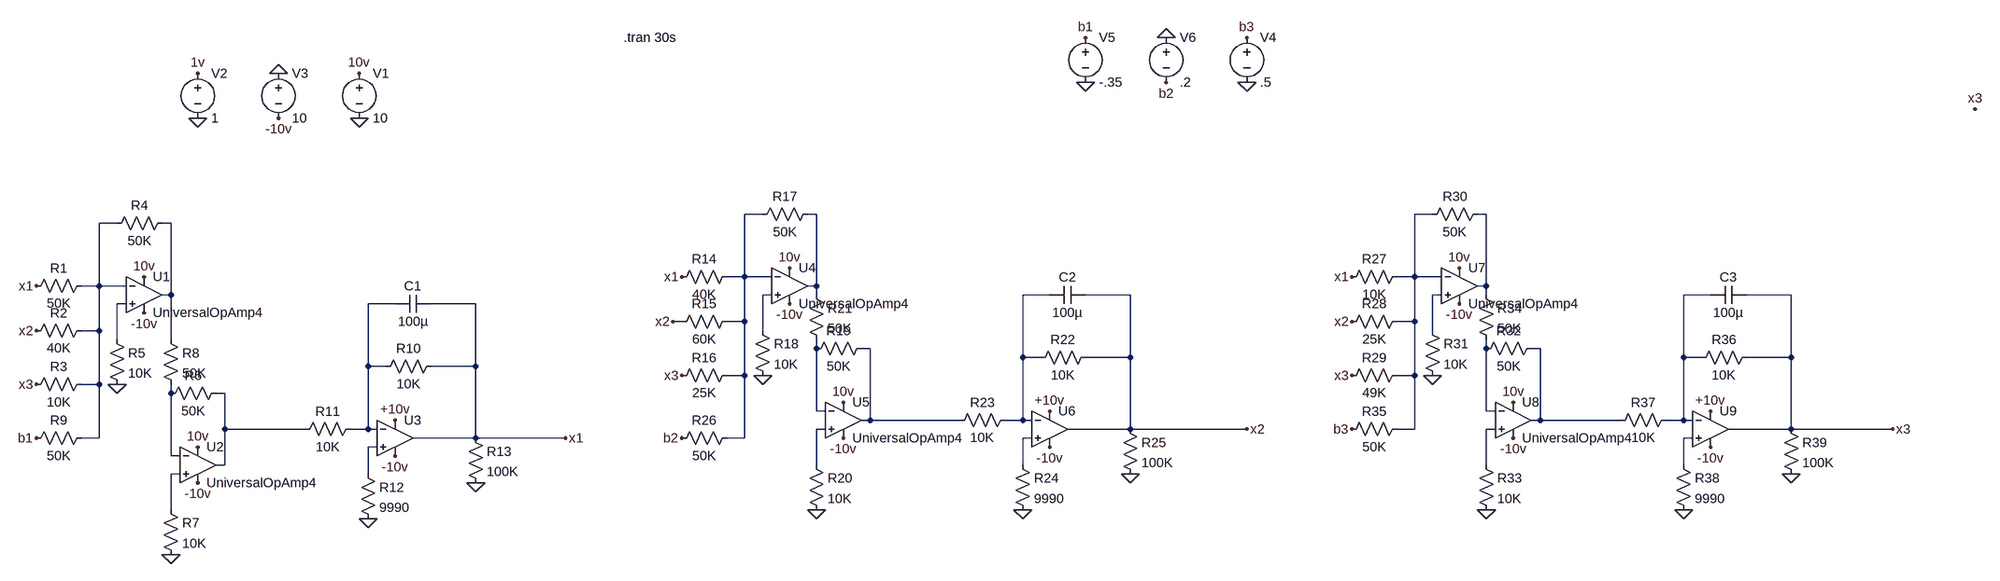
[diagram p0: schematic linear_solver.asc]
linear_solver.asc, the LTspice schematic file:
Version 4
SHEET 1 4384 2224
WIRE 640 448 608 448
WIRE 736 448 720 448
WIRE 1872 448 1840 448
WIRE 1968 448 1952 448
WIRE -512 464 -544 464
WIRE -416 464 -432 464
WIRE 608 560 608 448
WIRE 608 560 576 560
WIRE 656 560 608 560
WIRE 1840 560 1840 448
WIRE 1840 560 1808 560
WIRE 1888 560 1840 560
WIRE -544 576 -544 464
WIRE -544 576 -576 576
WIRE -496 576 -544 576
WIRE 736 576 736 448
WIRE 736 576 720 576
WIRE 1968 576 1968 448
WIRE 1968 576 1952 576
WIRE -416 592 -416 464
WIRE -416 592 -432 592
WIRE 656 592 640 592
WIRE 736 592 736 576
WIRE 1152 592 1104 592
WIRE 1296 592 1216 592
WIRE 1888 592 1872 592
WIRE 1968 592 1968 576
WIRE 2368 592 2320 592
WIRE 2512 592 2432 592
WIRE -496 608 -512 608
WIRE -16 608 -64 608
WIRE 128 608 48 608
WIRE 496 640 480 640
WIRE 608 640 608 560
WIRE 608 640 576 640
WIRE 1840 640 1840 560
WIRE 1840 640 1808 640
WIRE -544 656 -544 576
WIRE -544 656 -576 656
WIRE 640 656 640 592
WIRE 1872 656 1872 592
WIRE -512 672 -512 608
WIRE -416 672 -416 592
WIRE 736 688 736 672
WIRE 832 688 816 688
WIRE 1968 688 1968 672
WIRE 2064 688 2048 688
WIRE 1104 704 1104 592
WIRE 1136 704 1104 704
WIRE 1296 704 1296 592
WIRE 1296 704 1216 704
WIRE 2320 704 2320 592
WIRE 2352 704 2320 704
WIRE 2512 704 2512 592
WIRE 2512 704 2432 704
WIRE -64 720 -64 608
WIRE -32 720 -64 720
WIRE 128 720 128 608
WIRE 128 720 48 720
WIRE 608 736 608 640
WIRE 608 736 576 736
WIRE 1840 736 1840 640
WIRE 1840 736 1808 736
WIRE -544 752 -544 656
WIRE -544 752 -576 752
WIRE -416 768 -416 752
WIRE -320 768 -336 768
WIRE 736 800 736 688
WIRE 752 800 736 800
WIRE 1968 800 1968 688
WIRE 1984 800 1968 800
WIRE 832 816 832 688
WIRE 832 816 816 816
WIRE 992 816 832 816
WIRE 1104 816 1104 704
WIRE 1104 816 1072 816
WIRE 1120 816 1104 816
WIRE 2064 816 2064 688
WIRE 2064 816 2048 816
WIRE 2208 816 2064 816
WIRE 2320 816 2320 704
WIRE 2320 816 2288 816
WIRE 2336 816 2320 816
WIRE -320 832 -320 768
WIRE -176 832 -320 832
WIRE -64 832 -64 720
WIRE -64 832 -96 832
WIRE -48 832 -64 832
WIRE 752 832 736 832
WIRE 1296 832 1296 704
WIRE 1296 832 1184 832
WIRE 1504 832 1296 832
WIRE 1840 832 1840 736
WIRE 1840 832 1808 832
WIRE 1984 832 1968 832
WIRE 2512 832 2512 704
WIRE 2512 832 2400 832
WIRE 2720 832 2512 832
WIRE -544 848 -544 752
WIRE -544 848 -576 848
WIRE 128 848 128 720
WIRE 128 848 16 848
WIRE 288 848 128 848
WIRE 608 848 608 736
WIRE 608 848 576 848
WIRE 1120 848 1104 848
WIRE 2336 848 2320 848
WIRE -48 864 -64 864
WIRE -416 880 -416 768
WIRE -400 880 -416 880
WIRE -320 896 -320 832
WIRE -320 896 -336 896
WIRE 736 896 736 832
WIRE 1104 896 1104 848
WIRE 1968 896 1968 832
WIRE 2320 896 2320 848
WIRE -400 912 -416 912
WIRE -64 912 -64 864
WIRE -416 976 -416 912
FLAG -80 128 10v
FLAG -80 208 0
FLAG -368 128 1v
FLAG -368 208 0
FLAG -224 128 0
FLAG -224 208 -10v
FLAG 4352 192 x3
FLAG -464 560 10v
FLAG -512 752 0
FLAG -464 624 -10v
FLAG -368 864 10v
FLAG -416 1056 0
FLAG -368 928 -10v
FLAG -656 848 b1
FLAG -656 656 x2
FLAG -656 752 x3
FLAG -16 816 +10v
FLAG -16 880 -10v
FLAG -64 992 0
FLAG 128 928 0
FLAG 288 848 x1
FLAG 688 544 10v
FLAG 640 736 0
FLAG 688 608 -10v
FLAG 784 784 10v
FLAG 736 976 0
FLAG 784 848 -10v
FLAG 480 640 x2
FLAG 496 560 x1
FLAG 496 736 x3
FLAG 1152 800 +10v
FLAG 1152 864 -10v
FLAG 1104 976 0
FLAG 1296 912 0
FLAG 496 848 b2
FLAG 1504 832 x2
FLAG 1920 544 10v
FLAG 1872 736 0
FLAG 1920 608 -10v
FLAG 2016 784 10v
FLAG 1968 976 0
FLAG 2016 848 -10v
FLAG 1728 832 b3
FLAG 1728 560 x1
FLAG 1728 640 x2
FLAG 1728 736 x3
FLAG 2368 800 +10v
FLAG 2368 864 -10v
FLAG 2320 976 0
FLAG 2512 912 0
FLAG 2720 832 x3
FLAG 1504 64 b3
FLAG 1504 144 0
FLAG 1216 64 b1
FLAG 1216 144 0
FLAG 1360 64 0
FLAG 1360 144 b2
FLAG -656 576 x1
SYMBOL voltage -80 112 R0
WINDOW 123 0 0 Left 0
SYMATTR InstName V1
SYMATTR Value 10
SYMATTR SpiceLine Rser=.8
SYMBOL voltage -368 112 R0
WINDOW 123 0 0 Left 0
SYMATTR InstName V2
SYMATTR Value 1
SYMATTR SpiceLine Rser=.8
SYMBOL voltage -224 112 R0
WINDOW 123 0 0 Left 0
SYMATTR InstName V3
SYMATTR Value 10
SYMATTR SpiceLine Rser=.8
SYMBOL OpAmps\\UniversalOpAmp4 -464 592 R0
SYMATTR InstName U1
SYMBOL res -560 560 R90
WINDOW 0 0 56 VBottom 2
WINDOW 3 32 56 VTop 2
SYMATTR InstName R1
SYMATTR Value 50K
SYMBOL res -560 640 R90
WINDOW 0 0 56 VBottom 2
WINDOW 3 32 56 VTop 2
SYMATTR InstName R2
SYMATTR Value 40K
SYMBOL res -560 736 R90
WINDOW 0 0 56 VBottom 2
WINDOW 3 32 56 VTop 2
SYMATTR InstName R3
SYMATTR Value 10K
SYMBOL res -416 448 R90
WINDOW 0 0 56 VBottom 2
WINDOW 3 32 56 VTop 2
SYMATTR InstName R4
SYMATTR Value 50K
SYMBOL res -528 656 R0
SYMATTR InstName R5
SYMATTR Value 10K
SYMBOL OpAmps\\UniversalOpAmp4 -368 896 R0
SYMATTR InstName U2
SYMBOL res -320 752 R90
WINDOW 0 0 56 VBottom 2
WINDOW 3 32 56 VTop 2
SYMATTR InstName R6
SYMATTR Value 50K
SYMBOL res -432 960 R0
SYMATTR InstName R7
SYMATTR Value 10K
SYMBOL res -432 656 R0
SYMATTR InstName R8
SYMATTR Value 50K
SYMBOL res -560 832 R90
WINDOW 0 0 56 VBottom 2
WINDOW 3 32 56 VTop 2
SYMATTR InstName R9
SYMATTR Value 50K
SYMBOL OpAmps\\UniversalOpAmp -16 848 R0
SYMATTR InstName U3
SYMBOL res 64 704 R90
WINDOW 0 0 56 VBottom 2
WINDOW 3 32 56 VTop 2
SYMATTR InstName R10
SYMATTR Value 10K
SYMBOL cap 48 592 R90
WINDOW 0 0 32 VBottom 2
WINDOW 3 32 32 VTop 2
SYMATTR InstName C1
SYMATTR Value 100µ
SYMBOL res -80 816 R90
WINDOW 0 0 56 VBottom 2
WINDOW 3 32 56 VTop 2
SYMATTR InstName R11
SYMATTR Value 10K
SYMBOL res -80 896 R0
SYMATTR InstName R12
SYMATTR Value 9990
SYMBOL res 112 832 R0
SYMATTR InstName R13
SYMATTR Value 100K
SYMBOL OpAmps\\UniversalOpAmp4 688 576 R0
SYMATTR InstName U4
SYMBOL res 592 544 R90
WINDOW 0 0 56 VBottom 2
WINDOW 3 32 56 VTop 2
SYMATTR InstName R14
SYMATTR Value 40K
SYMBOL res 592 624 R90
WINDOW 0 0 56 VBottom 2
WINDOW 3 32 56 VTop 2
SYMATTR InstName R15
SYMATTR Value 60K
SYMBOL res 592 720 R90
WINDOW 0 0 56 VBottom 2
WINDOW 3 32 56 VTop 2
SYMATTR InstName R16
SYMATTR Value 25K
SYMBOL res 736 432 R90
WINDOW 0 0 56 VBottom 2
WINDOW 3 32 56 VTop 2
SYMATTR InstName R17
SYMATTR Value 50K
SYMBOL res 624 640 R0
SYMATTR InstName R18
SYMATTR Value 10K
SYMBOL OpAmps\\UniversalOpAmp4 784 816 R0
SYMATTR InstName U5
SYMBOL res 832 672 R90
WINDOW 0 0 56 VBottom 2
WINDOW 3 32 56 VTop 2
SYMATTR InstName R19
SYMATTR Value 50K
SYMBOL res 720 880 R0
SYMATTR InstName R20
SYMATTR Value 10K
SYMBOL res 720 576 R0
SYMATTR InstName R21
SYMATTR Value 50K
SYMBOL OpAmps\\UniversalOpAmp 1152 832 R0
SYMATTR InstName U6
SYMBOL res 1232 688 R90
WINDOW 0 0 56 VBottom 2
WINDOW 3 32 56 VTop 2
SYMATTR InstName R22
SYMATTR Value 10K
SYMBOL cap 1216 576 R90
WINDOW 0 0 32 VBottom 2
WINDOW 3 32 32 VTop 2
SYMATTR InstName C2
SYMATTR Value 100µ
SYMBOL res 1088 800 R90
WINDOW 0 0 56 VBottom 2
WINDOW 3 32 56 VTop 2
SYMATTR InstName R23
SYMATTR Value 10K
SYMBOL res 1088 880 R0
SYMATTR InstName R24
SYMATTR Value 9990
SYMBOL res 1280 816 R0
SYMATTR InstName R25
SYMATTR Value 100K
SYMBOL res 592 832 R90
WINDOW 0 0 56 VBottom 2
WINDOW 3 32 56 VTop 2
SYMATTR InstName R26
SYMATTR Value 50K
SYMBOL OpAmps\\UniversalOpAmp4 1920 576 R0
SYMATTR InstName U7
SYMBOL res 1824 544 R90
WINDOW 0 0 56 VBottom 2
WINDOW 3 32 56 VTop 2
SYMATTR InstName R27
SYMATTR Value 10K
SYMBOL res 1824 624 R90
WINDOW 0 0 56 VBottom 2
WINDOW 3 32 56 VTop 2
SYMATTR InstName R28
SYMATTR Value 25K
SYMBOL res 1824 720 R90
WINDOW 0 0 56 VBottom 2
WINDOW 3 32 56 VTop 2
SYMATTR InstName R29
SYMATTR Value 49K
SYMBOL res 1968 432 R90
WINDOW 0 0 56 VBottom 2
WINDOW 3 32 56 VTop 2
SYMATTR InstName R30
SYMATTR Value 50K
SYMBOL res 1856 640 R0
SYMATTR InstName R31
SYMATTR Value 10K
SYMBOL OpAmps\\UniversalOpAmp4 2016 816 R0
SYMATTR InstName U8
SYMBOL res 2064 672 R90
WINDOW 0 0 56 VBottom 2
WINDOW 3 32 56 VTop 2
SYMATTR InstName R32
SYMATTR Value 50K
SYMBOL res 1952 880 R0
SYMATTR InstName R33
SYMATTR Value 10K
SYMBOL res 1952 576 R0
SYMATTR InstName R34
SYMATTR Value 50K
SYMBOL res 1824 816 R90
WINDOW 0 0 56 VBottom 2
WINDOW 3 32 56 VTop 2
SYMATTR InstName R35
SYMATTR Value 50K
SYMBOL OpAmps\\UniversalOpAmp 2368 832 R0
SYMATTR InstName U9
SYMBOL res 2448 688 R90
WINDOW 0 0 56 VBottom 2
WINDOW 3 32 56 VTop 2
SYMATTR InstName R36
SYMATTR Value 10K
SYMBOL cap 2432 576 R90
WINDOW 0 0 32 VBottom 2
WINDOW 3 32 32 VTop 2
SYMATTR InstName C3
SYMATTR Value 100µ
SYMBOL res 2304 800 R90
WINDOW 0 0 56 VBottom 2
WINDOW 3 32 56 VTop 2
SYMATTR InstName R37
SYMATTR Value 10K
SYMBOL res 2304 880 R0
SYMATTR InstName R38
SYMATTR Value 9990
SYMBOL res 2496 816 R0
SYMATTR InstName R39
SYMATTR Value 100K
SYMBOL voltage 1504 48 R0
WINDOW 123 0 0 Left 0
SYMATTR InstName V4
SYMATTR Value .5
SYMATTR SpiceLine Rser=.8
SYMBOL voltage 1216 48 R0
WINDOW 123 0 0 Left 0
SYMATTR InstName V5
SYMATTR Value -.35
SYMATTR SpiceLine Rser=.8
SYMBOL voltage 1360 48 R0
WINDOW 123 0 0 Left 0
SYMATTR InstName V6
SYMATTR Value .2
SYMATTR SpiceLine Rser=.8
TEXT 392 64 Left 2 !.tran 30s

The netlist it stands for:
* linear_solver.asc
V1 10v 0 10 Rser=.8
V2 1v 0 1 Rser=.8
V3 0 -10v 10 Rser=.8
* U1: UniversalOpAmp4 (symbol OpAmps\UniversalOpAmp4 not available, pins judged from their places): In+=N011 In-=N005 V+=10v V-=-10v OUT=N006
R1 N005 x1 50K
R2 N005 x2 40K
R3 N005 x3 10K
R4 N006 N005 50K
R5 N011 0 10K
* U2: UniversalOpAmp4 (symbol OpAmps\UniversalOpAmp4 not available, pins judged from their places): In+=N024 In-=N017 V+=10v V-=-10v OUT=N018
R6 N018 N017 50K
R7 N024 0 10K
R8 N006 N017 50K
R9 N005 b1 50K
XU3 N023 N012 +10v -10v x1 level1 Avol=1Meg GBW=10Meg Vos=0 En=0 Enk=0 In=0 Ink=0 Rin=500Meg  ; pins In+ In- V+ V- OUT
R10 x1 N012 10K
C1 x1 N012 100µ
R11 N012 N018 10K
R12 N023 0 9990
R13 x1 0 100K
* U4: UniversalOpAmp4 (symbol OpAmps\UniversalOpAmp4 not available, pins judged from their places): In+=N007 In-=N001 V+=10v V-=-10v OUT=N002
R14 N001 x1 40K
R15 N001 x2 60K
R16 N001 x3 25K
R17 N002 N001 50K
R18 N007 0 10K
* U5: UniversalOpAmp4 (symbol OpAmps\UniversalOpAmp4 not available, pins judged from their places): In+=N019 In-=N013 V+=10v V-=-10v OUT=N014
R19 N014 N013 50K
R20 N019 0 10K
R21 N002 N013 50K
XU6 N021 N008 +10v -10v x2 level1 Avol=1Meg GBW=10Meg Vos=0 En=0 Enk=0 In=0 Ink=0 Rin=500Meg  ; pins In+ In- V+ V- OUT
R22 x2 N008 10K
C2 x2 N008 100µ
R23 N008 N014 10K
R24 N021 0 9990
R25 x2 0 100K
R26 N001 b2 50K
* U7: UniversalOpAmp4 (symbol OpAmps\UniversalOpAmp4 not available, pins judged from their places): In+=N009 In-=N003 V+=10v V-=-10v OUT=N004
R27 N003 x1 10K
R28 N003 x2 25K
R29 N003 x3 49K
R30 N004 N003 50K
R31 N009 0 10K
* U8: UniversalOpAmp4 (symbol OpAmps\UniversalOpAmp4 not available, pins judged from their places): In+=N020 In-=N015 V+=10v V-=-10v OUT=N016
R32 N016 N015 50K
R33 N020 0 10K
R34 N004 N015 50K
R35 N003 b3 50K
XU9 N022 N010 +10v -10v x3 level1 Avol=1Meg GBW=10Meg Vos=0 En=0 Enk=0 In=0 Ink=0 Rin=500Meg  ; pins In+ In- V+ V- OUT
R36 x3 N010 10K
C3 x3 N010 100µ
R37 N010 N016 10K
R38 N022 0 9990
R39 x3 0 100K
V4 b3 0 .5 Rser=.8
V5 b1 0 -.35 Rser=.8
V6 0 b2 .2 Rser=.8
.tran 30s
.lib UniversalOpAmp1.lib
.backanno
.end